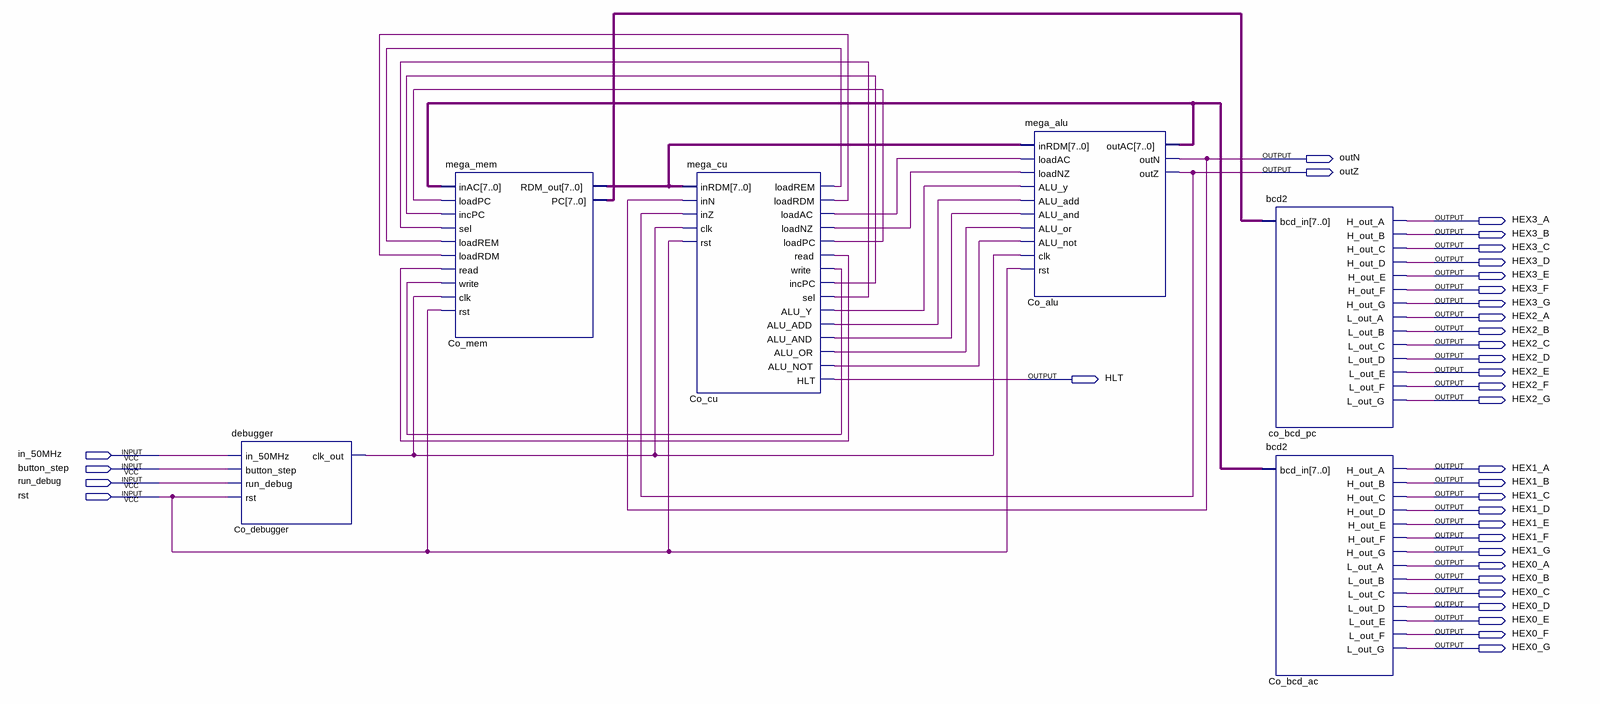
[diagram p0: schematic sheet]
// Quartus schematic neander.bdf as structural Verilog: 6 symbols, 35 pins
module neander (
  input  in_50MHz,
  input  button_step,
  input  run_debug,
  input  rst,
  output outN,
  output outZ,
  output HEX3_A,
  output HEX3_B,
  output HEX3_C,
  output HEX3_D,
  output HEX3_E,
  output HEX3_F,
  output HEX3_G,
  output HEX2_A,
  output HEX2_B,
  output HEX2_C,
  output HEX2_D,
  output HEX2_E,
  output HLT,
  output HEX2_F,
  output HEX2_G,
  output HEX1_A,
  output HEX1_B,
  output HEX1_C,
  output HEX1_D,
  output HEX1_E,
  output HEX1_F,
  output HEX1_G,
  output HEX0_A,
  output HEX0_B,
  output HEX0_C,
  output HEX0_D,
  output HEX0_E,
  output HEX0_F,
  output HEX0_G
);

  wire Co_cu_alu_add, Co_cu_alu_and, Co_cu_alu_not, Co_cu_alu_or, Co_cu_alu_y, Co_cu_incpc, Co_cu_loadac,
       Co_cu_loadnz, Co_cu_loadpc, Co_cu_loadrdm, Co_cu_loadrem, Co_cu_read, Co_cu_sel, Co_cu_write,
       Co_debugger_clk_out;
  wire [7:0] Co_alu_outac, Co_mem_pc, Co_mem_rdm_out;

  debugger Co_debugger (
    .in_50MHz(in_50MHz), .button_step(button_step), .run_debug(run_debug), .rst(rst),
    .clk_out(Co_debugger_clk_out));
  mega_mem Co_mem (
    .inAC(Co_alu_outac), .loadPC(Co_cu_loadpc), .incPC(Co_cu_incpc), .sel(Co_cu_sel),
    .loadREM(Co_cu_loadrem), .loadRDM(Co_cu_loadrdm), .read(Co_cu_read), .write(Co_cu_write),
    .clk(Co_debugger_clk_out), .rst(rst), .RDM_out(Co_mem_rdm_out), .PC(Co_mem_pc));
  mega_cu Co_cu (
    .inRDM(Co_mem_rdm_out), .inN(outN), .inZ(outZ), .clk(Co_debugger_clk_out), .rst(rst),
    .loadREM(Co_cu_loadrem), .loadRDM(Co_cu_loadrdm), .loadAC(Co_cu_loadac), .loadNZ(Co_cu_loadnz),
    .loadPC(Co_cu_loadpc), .read(Co_cu_read), .write(Co_cu_write), .incPC(Co_cu_incpc), .sel(Co_cu_sel),
    .ALU_Y(Co_cu_alu_y), .ALU_ADD(Co_cu_alu_add), .ALU_AND(Co_cu_alu_and), .ALU_OR(Co_cu_alu_or),
    .ALU_NOT(Co_cu_alu_not), .HLT(HLT));
  mega_alu Co_alu (
    .inRDM(Co_mem_rdm_out), .loadAC(Co_cu_loadac), .loadNZ(Co_cu_loadnz), .ALU_y(Co_cu_alu_y),
    .ALU_add(Co_cu_alu_add), .ALU_and(Co_cu_alu_and), .ALU_or(Co_cu_alu_or), .ALU_not(Co_cu_alu_not),
    .clk(Co_debugger_clk_out), .rst(rst), .outAC(Co_alu_outac), .outN(outN), .outZ(outZ));
  bcd2 co_bcd_pc (
    .bcd_in(Co_mem_pc), .H_out_A(HEX3_A), .H_out_B(HEX3_B), .H_out_C(HEX3_C), .H_out_D(HEX3_D),
    .H_out_E(HEX3_E), .H_out_F(HEX3_F), .H_out_G(HEX3_G), .L_out_A(HEX2_A), .L_out_B(HEX2_B),
    .L_out_C(HEX2_C), .L_out_D(HEX2_D), .L_out_E(HEX2_E), .L_out_F(HEX2_F), .L_out_G(HEX2_G));
  bcd2 Co_bcd_ac (
    .bcd_in(Co_alu_outac), .H_out_A(HEX1_A), .H_out_B(HEX1_B), .H_out_C(HEX1_C), .H_out_D(HEX1_D),
    .H_out_E(HEX1_E), .H_out_F(HEX1_F), .H_out_G(HEX1_G), .L_out_A(HEX0_A), .L_out_B(HEX0_B),
    .L_out_C(HEX0_C), .L_out_D(HEX0_D), .L_out_E(HEX0_E), .L_out_F(HEX0_F), .L_out_G(HEX0_G));
endmodule
